# EAGLE design lightningbug (EAGLE 6.6.0)
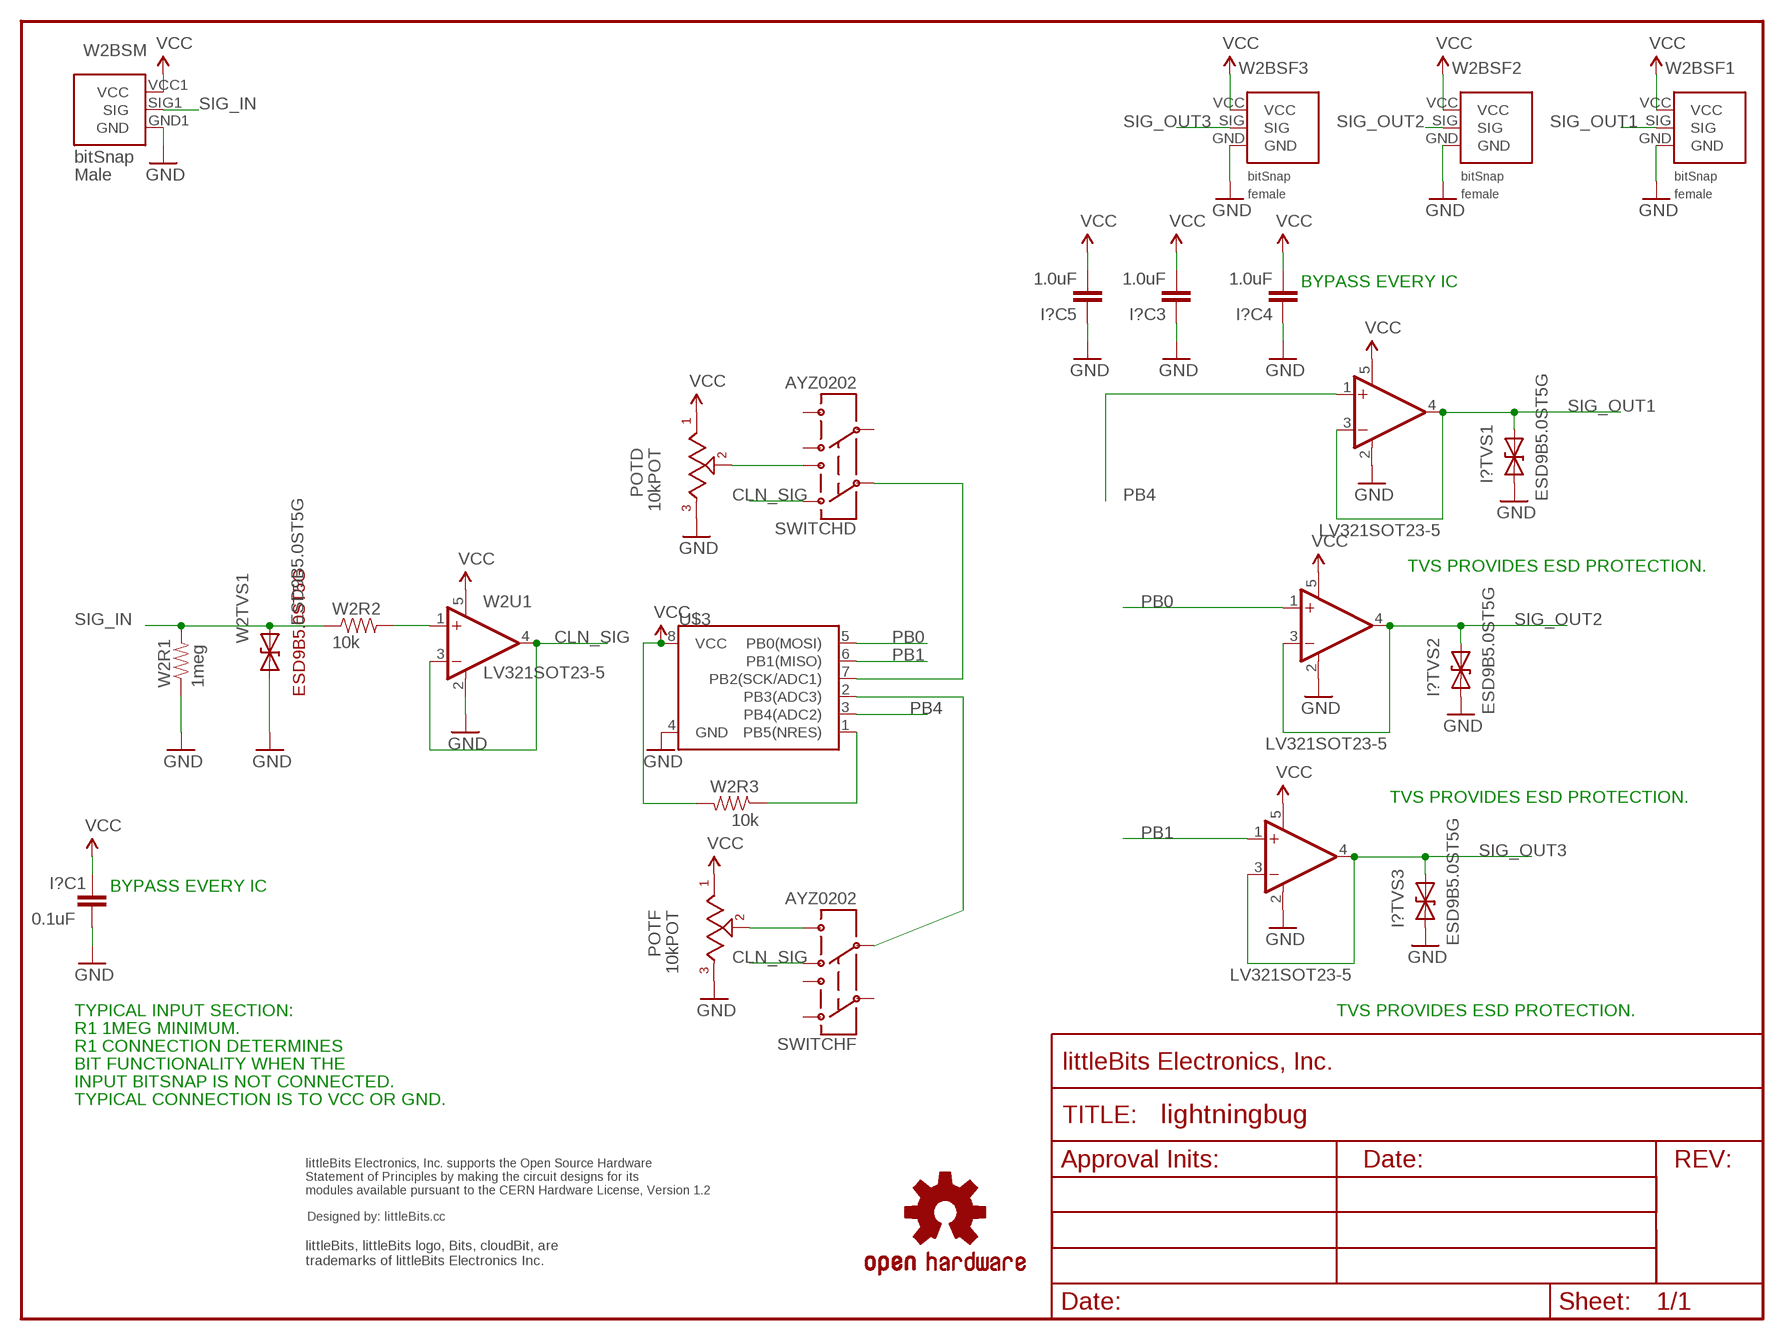
[diagram p0: schematic, sheet 1]

## Parts
FRAME1  FRAME-LETTER  [FABDWG01-OHW]
I?C1  0.1uF  CAPCAP-0603  [CAP-0603]
I?C3  1.0uF  CAPCAP-0603  [CAP-0603]
I?C4  1.0uF  CAPCAP-0603  [CAP-0603]
I?C5  1.0uF  CAPCAP-0603  [CAP-0603]
I?TVS1  ESD9B5.0ST5G  DIODE-TVSSOD-923  [SOD-923]
I?TVS2  ESD9B5.0ST5G  DIODE-TVSSOD-923  [SOD-923]
I?TVS3  ESD9B5.0ST5G  DIODE-TVSSOD-923  [SOD-923]
POTD  10kPOT  TRIMPOT_SMD_3MM  [TRIMPOT_SMD_3MM]
POTF  10kPOT  TRIMPOT_SMD_3MM  [TRIMPOT_SMD_3MM]
SWITCHD  AYZ0202  [AYZ0202]
SWITCHF  AYZ0202  [AYZ0202]
U1  LV321SOT23-5  [SOT23-5]
U2  LV321SOT23-5  [SOT23-5]
U3  LV321SOT23-5  [SOT23-5]
U$1  OSHWCREDIT  [OSHWCREDIT]
U$3  ATTINY85  [SO08-EIAJ]
U$6  OSHW-LOGOL  [OSHW-LOGO-L]
W2BSF1  BITSNAP_V03_FEMALE  [BITSNAP_V03_FEMALE]
W2BSF2  BITSNAP_V03_FEMALE  [BITSNAP_V03_FEMALE]
W2BSF3  BITSNAP_V03_FEMALE  [BITSNAP_V03_FEMALE]
W2BSM  BITSNAP_V03_MALE  [BITSNAP_V03_MALE]
W2R1  1meg  RESISTOR0603  [RES-0603]
W2R2  10k  RESISTOR0603  [RES-0603]
W2R3  10k  RES-0603  [RES-0603]
W2TVS1  ESD9B5.0ST5G  DIODE-TVSSOD-923  [SOD-923]
W2U1  LV321SOT23-5  [SOT23-5]

## Nets
CLN_SIG: SWITCHD.1 SWITCHF.4 W2U1.3(-IN) W2U1.4(OUT)
GND: I?C1.2 I?C3.1 I?C4.1 I?C5.1 I?TVS1.1(A) I?TVS2.1(A) I?TVS3.1(A) POTD.3 POTF.3 U1.2(V-) U2.2(V-) U3.2(V-) U$3.4(GND) W2BSF1.GND W2BSF2.GND W2BSF3.GND W2BSM.GND1(GND) W2R1.1 W2TVS1.1(A) W2U1.2(V-)
N$1: POTF.2 SWITCHF.6
N$3: W2R2.2 W2U1.1(+IN)
N$5: POTD.2 SWITCHD.3
NRES: U$3.1(PB5(NRES)) W2R3.1
PB0: U2.1(+IN) U$3.5(PB0(MOSI))
PB1: U3.1(+IN) U$3.6(PB1(MISO))
PB2: SWITCHD.2 U$3.7(PB2(SCK/ADC1))
PB3: SWITCHF.5 U$3.2(PB3(ADC3))
PB4: U1.1(+IN) U$3.3(PB4(ADC2))
SIG_IN: W2BSM.SIG1(SIG) W2R1.2 W2R2.1 W2TVS1.2(C)
SIG_OUT1: I?TVS1.2(C) U1.3(-IN) U1.4(OUT) W2BSF1.SIG
SIG_OUT2: I?TVS2.2(C) U2.3(-IN) U2.4(OUT) W2BSF2.SIG
SIG_OUT3: I?TVS3.2(C) U3.3(-IN) U3.4(OUT) W2BSF3.SIG
VCC: I?C1.1 I?C3.2 I?C4.2 I?C5.2 POTD.1 POTF.1 U1.5(V+) U2.5(V+) U3.5(V+) U$3.8(VCC) W2BSF1.VCC W2BSF2.VCC W2BSF3.VCC W2BSM.VCC1(VCC) W2R3.2 W2U1.5(V+)
Unconnected: SWITCHD.4 SWITCHD.5 SWITCHD.6 SWITCHF.1 SWITCHF.2 SWITCHF.3

## Notes on the sheet
- BYPASS EVERY IC
- TVS PROVIDES ESD PROTECTION.
- TVS PROVIDES ESD PROTECTION.
- BYPASS EVERY IC
- TYPICAL INPUT SECTION: | TVS PROVIDES ESD PROTECTION.
- R1 1MEG MINIMUM.
- R1 CONNECTION DETERMINES
- BIT FUNCTIONALITY WHEN THE
- INPUT BITSNAP IS NOT CONNECTED.
- TYPICAL CONNECTION IS TO VCC OR GND.

## Library data of the parts
FRAME1 = LITTLEBITS:FRAME-LETTER
I?C1 I?C3-I?C5 = LITTLEBITS:CAP
I?TVS1-I?TVS3 W2TVS1 = LITTLEBITS:DIODE-TVS: Bidirectional Transient Voltage Suppression Diode: Device conducts in avalanche mode after reaching a part dependent voltage threshold. Used for limiting voltage spikes on ESD sensitive inputs and outputs.; IEC_ESD_PROT0: +/-18kV; LB_PN: ?; MPN: ESD9B5.0ST5G; V_CLAMP: ?; V_OPERATION: 5V
POTD POTF = LITTLEBITS140915:TRIMPOT_SMD_3MM
SWITCHD SWITCHF = LITTLEBITS140915:AYZ0202
U1-U3 W2U1 = LITTLEBITS:LV321
U$1 = LITTLEBITS:OSHWCREDIT
U$3 = LITTLEBITS140915:ATTINY85
U$6 = LITTLEBITS140915:OSHW-LOGO: Open Source Hardware Logo This logo indicates the piece of hardware it is found on incorporates a OSHW license and/or adheres to the definition of open source hardware found here: http://freedomdefined.org/OSHW
W2BSF1-W2BSF3 = bitSnap:BITSNAP_V03_FEMALE
W2BSM = bitSnap:BITSNAP_V03_MALE
W2R1 W2R2 = LITTLEBITS:RESISTOR
W2R3 = LITTLEBITS140915:RES-0603: Resistor

## Board
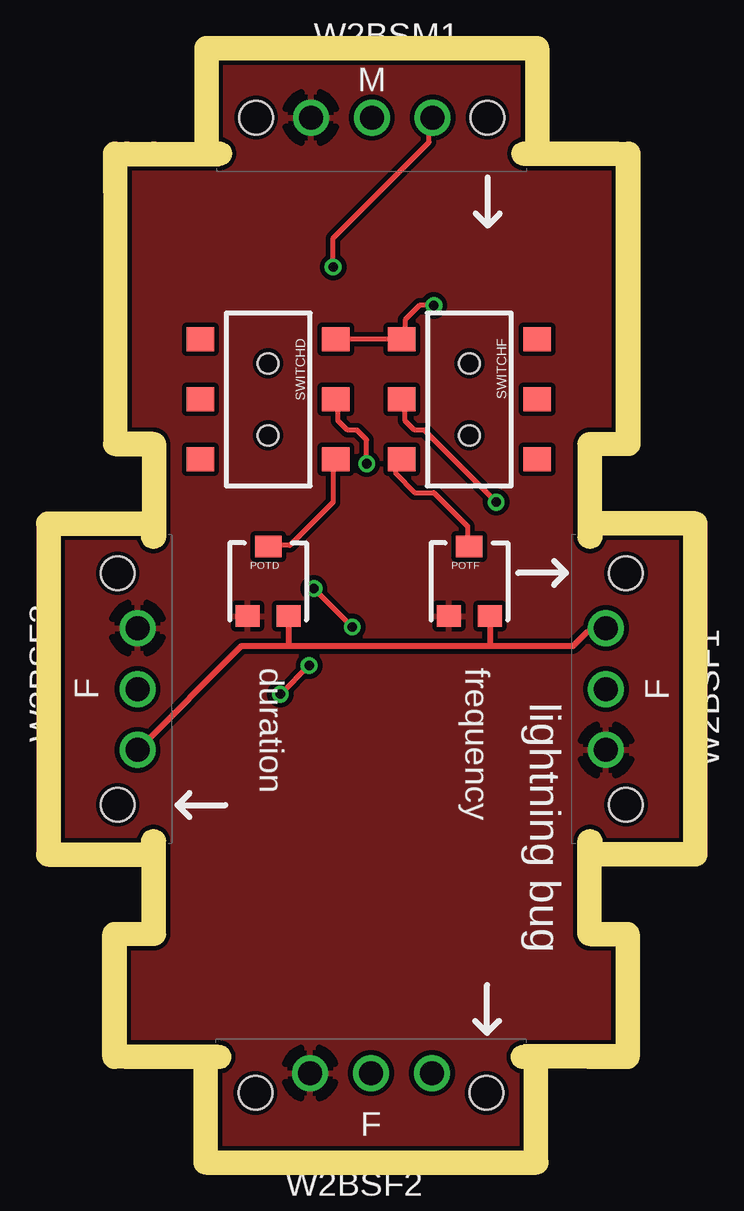
[diagram p1: board, top side]
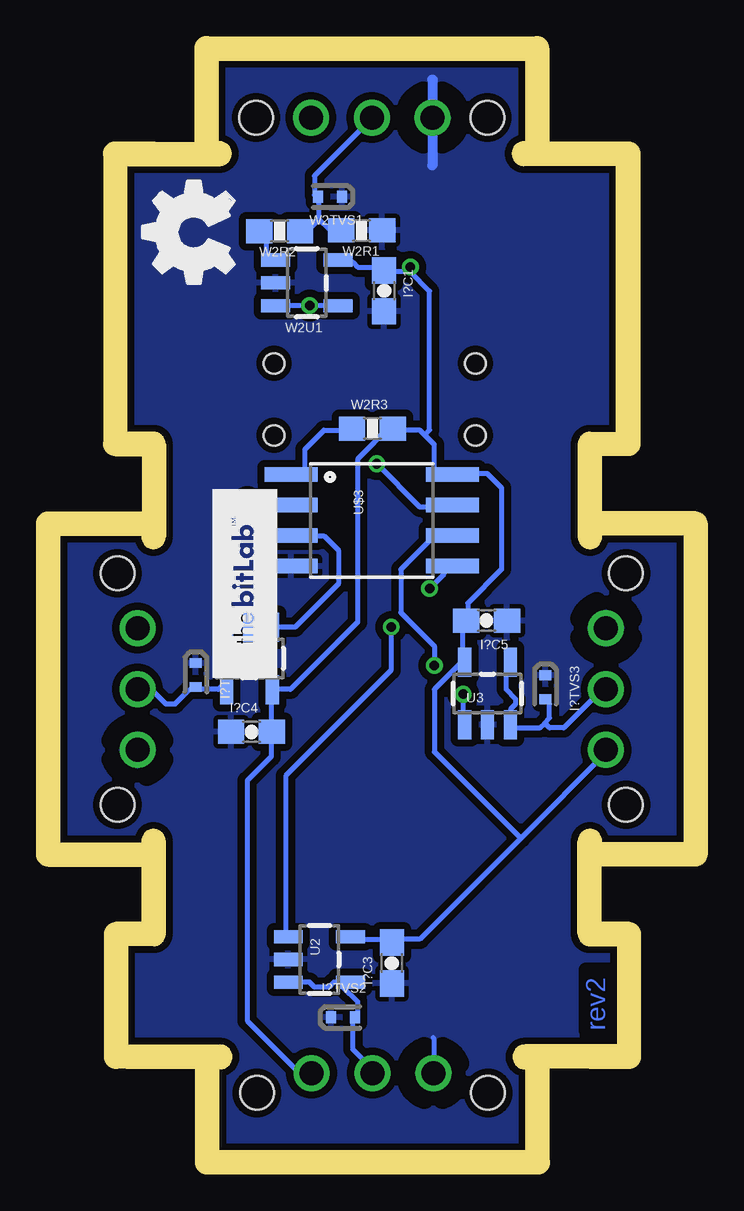
[diagram p2: board, bottom side, seen from below]

Size 26 x 45.44 mm. Coordinates in mm from the lower left corner, seen from the top.
Outline: 2.77,4.4 2.77,8.53 3.89,8.53 arc90 4.4,9.03
Outline: 23.17,4.4 23.17,8.53 22.1,8.53 arc-90 21.6,9.03
Outline: 23.2,41.04 23.2,29.93 22.1,29.93 arc90 21.6,29.43
Outline: 4.4,29.43 arc90 3.9,29.93 2.8,29.93 2.8,41.04
Copper layers (1*16): Top 0.035mm / dielectric 1.5mm / Bottom 0.035mm
Design rules "littleBitsDRC": minimum track width 0.2mm, minimum drill 0.4mm, track to track 0.2mm, track to pad 0.2mm, pad to pad 0.2mm, via to via 0.2mm, smd to smd 0mil, copper to edge 0.2mm, drill to drill 0.2mm, minimum pad ring 0.2mm, minimum via ring 0.15mm, stop-mask expansion 0.1mm, vias tented up to drill 0mil, thermal gap 0.2mm
Milling: 13 lines

### Footprints (pad centres in the part's own frame; a part is rotated, then mirrored left to right if it is on the bottom)
CAP-0603 = smd 1.1 x 1: 1 -0.85,0; 2 0.85,0
SOD-923 = smd 0.4 x 0.5: 1 -0.5,0; 2 0.5,0
TRIMPOT_SMD_3MM = smd 1 x 0.9: 1 0.85,-1.45; 3 -0.85,-1.45 | smd 1.1 x 0.9: 2 0,1.45
AYZ0202 = smd 1 x 1.15: 1 -2.5,2.825; 2 0,2.825; 3 2.5,2.825; 4 -2.5,-2.825; 5 0,-2.825; 6 2.5,-2.825 | hole 0.85: 1.5,0; -1.5,0
SOT23-5 = smd 0.55 x 1.2: 1 -0.95,-1.3; 2 0,-1.3; 3 0.95,-1.3; 4 0.95,1.3; 5 -0.95,1.3
SO08-EIAJ = smd 0.61 x 2.21: 1 -1.905,-3.378; 2 -0.635,-3.378; 3 0.635,-3.378; 4 1.905,-3.378; 5 1.905,3.353; 6 0.635,3.353; 7 -0.635,3.353; 8 -1.905,3.353
BITSNAP_V03_FEMALE = drill 1: GND 4.065,3.44; SIG 6.605,3.44; VCC 9.145,3.44 | hole 1.4: 1.785,2.61; 11.425,2.61
BITSNAP_V03_MALE = drill 1: GND1 9.145,2.61; SIG1 6.605,2.61; VCC1 4.065,2.61 | hole 1.4: 1.785,2.61; 11.425,2.61
RES-0603 = smd 1.1 x 1: 1 -0.85,0; 2 0.85,0

### Placement (x,y rotation side)
FRAME1  -0.21,-0.58 0 top
I?C1  12.48,35.82 270 bottom
I?C3  12.16,7.82 90 bottom
I?C4  18.02,17.45 0 bottom
I?C5  8.21,22.09 180 bottom
I?TVS1  20.34,19.81 270 bottom
I?TVS2  14.2,5.55 0 bottom
I?TVS3  5.76,19.3 270 bottom
POTD  8.68,23.71 0 top
POTF  17.07,23.71 0 top
SWITCHD  8.68,31.29 270 top
SWITCHF  17.07,31.29 270 top
U1  18.1,20.5 180 bottom
U2  15.18,7.97 270 bottom
U3  8.17,19.04 0 bottom
U$1  -92.58,-62.55 0 top  (outside the outline)
U$2  [BITLAB-LOGO]  16.95,27.54 270 top
U$3  12.99,26.26 270 bottom
U$5  [OSHW_FILLX150_NOTEXT]  18.74,35.31 0 top
U$6  -33.62,-68.41 0 top  (outside the outline)
W2BSF1  26.21,12.62 90 top
W2BSF2  6.37,-0.21 0 top
W2BSF3  -0.21,25.84 270 top
W2BSM  19.61,45.65 180 top
W2R1  13.42,38.34 180 bottom
W2R2  16.84,38.31 180 bottom
W2R3  12.97,30.08 0 bottom
W2TVS1  14.74,39.74 180 bottom
W2U1  15.71,36.16 270 bottom

### Tracks (layer width: path | path; a pad name or v marks a point on that pad's centre or on a via)
CLN_SIG  (via drill 0.4)
  Top 0.2: SWITCHD.1 11.59,33.81 14.19,33.81 SWITCHF.4 14.39,33.81 14.39,34.62 14.99,35.21 v15.59,35.21
  Bottom 0.2: W2U1.4 14.59,35.21 v15.59,35.21 16.99,35.21 W2U1.3
GND
  Bottom 0.2: 10.43,4.7 10.39,4.62 10.39,3.42 W2BSF2.GND
  Bottom 0.406: 10.45,44.62 10.47,44.62 10.47,41.04
  pour Bottom (isolate 0.305): 0.11,45.3 25.82,45.47 25.77,-0.11 0.16,-0.32
  pour Top: 0.2,45.41 25.93,45.44 25.88,-0.16 0.25,-0.21
N$1
  Top 0.2: POTF.2 16.99,25.21 16.99,26.02 15.59,27.41 14.79,27.41 13.99,28.21 13.99,28.41 14.19,28.61 SWITCHF.6
N$3
  Bottom 0.2: W2R2.2 17.39,38.21 17.39,37.41 17.19,37.21 W2U1.1
N$5
  Top 0.2: POTD.2 8.79,25.21 9.59,25.21 11.39,27.02 11.39,28.61 SWITCHD.3
NRES
  Bottom 0.2: W2R3.1 13.99,30.02 14.99,30.02 15.79,29.21 15.79,28.41 16.19,28.02 U$3.1
PB0  (via drill 0.4)
  Top 0.2: v10.59,23.41 v12.19,21.81
  Bottom 0.2: v12.19,21.81 12.19,20.02 16.59,15.61 16.59,9.02 U2.1 | v10.59,23.41 9.99,24.02 9.99,24.21 9.79,24.41 U$3.5
PB1  (via drill 0.4)
  Top 0.2: v10.39,20.21 v9.19,19.02
  Bottom 0.2: v9.19,19.02 9.19,17.81 U3.1 | v10.39,20.21 10.39,21.02 11.79,22.41 11.79,24.21 10.39,25.61 9.79,25.61 U$3.6
PB2  (via drill 0.4)
  Top 0.2: v12.79,28.61 12.79,29.61 12.39,30.02 11.99,30.02 11.59,30.41 11.59,31.21 SWITCHD.2
  Bottom 0.2: v12.79,28.61 10.99,26.81 9.79,26.81 U$3.7
PB3  (via drill 0.4)
  Top 0.2: v18.19,27.02 15.19,30.02 14.79,30.02 14.39,30.41 14.39,31.21 SWITCHF.5
  Bottom 0.2: v18.19,27.02 17.99,26.81 16.39,26.81 U$3.2
PB4
  Bottom 0.2: U1.1 16.99,21.81 16.19,21.81 14.39,23.61 14.39,25.02 14.99,25.61 16.19,25.61 U$3.3
SIG_IN
  Bottom 0.2: 15.19,38.81 15.19,39.62 W2TVS1.2 15.39,39.81 15.39,40.62 12.99,43.02 W2BSM.SIG1 | 15.19,38.81 15.59,38.41 W2R2.1 15.19,38.81 | 15.19,38.81 14.79,38.41 14.39,38.41 W2R1.2
SIG_OUT1
  Bottom 0.2: 18.99,19.21 19.19,19.41 19.39,19.21 20.19,19.21 I?TVS1.2 20.39,19.21 20.59,19.21 21.19,18.61 21.59,18.61 22.19,19.21 22.59,19.21 W2BSF1.SIG | 18.99,19.21 18.99,19.81 19.19,20.02 19.19,21.61 U1.3 | 18.99,19.21 U1.4
SIG_OUT2
  Bottom 0.2: 14.19,7.01 14.19,6.82 13.59,6.21 13.59,5.62 I?TVS2.2 13.79,5.42 13.79,4.21 12.99,3.42 W2BSF2.SIG | 14.19,7.01 U2.4 13.99,7.01 | U2.3 15.59,7.01 15.39,6.82 14.79,6.82 14.59,7.01 14.19,7.01
SIG_OUT3
  Bottom 0.2: 5.79,17.81 5.99,17.61 7.19,17.61 U3.3 7.19,17.81 7.19,18.41 6.99,18.61 6.99,18.81 7.39,19.21 7.39,20.21 U3.4 | 5.79,17.81 5.59,18.02 5.59,18.61 I?TVS3.2 | 5.79,17.81 5.59,17.61 4.99,17.61 3.39,19.21 W2BSF3.SIG
VCC  (via drill 0.4)
  Top 0.2: 22.59,21.61 W2BSF1.VCC | 3.19,16.81 W2BSF3.VCC | v11.39,36.81 11.39,38.02 15.39,42.02 15.39,43.02 W2BSM.VCC1
  Top 0.254: 17.88,21.02 21.39,21.02 21.99,21.61 22.59,21.61 | 17.88,21.02 9.44,21.02 | 9.44,21.02 7.55,21.02 W2BSF3.VCC | POTF.1 17.92,21.06 17.88,21.02 | POTD.1 9.53,21.1 9.44,21.02
  Bottom 0.2: U2.5 13.79,8.82 12.19,8.82 I?C3.2 11.99,8.82 10.99,8.82 6.79,13.02 | 6.79,13.02 3.19,16.61 W2BSF3.VCC | W2U1.5 14.39,37.02 13.79,37.02 13.59,36.81 12.59,36.81 I?C1.1 12.39,36.62 11.39,36.62 | 9.19,20.41 9.19,22.02 I?C5.2 8.99,22.21 8.99,22.81 7.59,24.21 7.59,27.61 8.19,28.21 9.59,28.21 U$3.8 9.79,28.21 10.19,28.21 10.39,28.41 10.39,29.41 10.79,29.81 | 10.79,29.81 10.99,30.02 11.99,30.02 W2R3.2 12.19,30.21 13.59,28.81 13.59,22.02 16.39,19.21 16.99,19.21 U1.5 17.19,19.02 17.19,17.61 I?C4.2 17.19,17.41 17.19,16.41 18.19,15.41 18.19,5.42 16.19,3.42 15.59,3.42 W2BSF2.VCC | 11.39,36.62 10.59,35.81 10.59,30.02 10.79,29.81 | 11.39,36.62 v11.39,36.81 | 6.79,13.02 10.39,16.61 10.39,19.21 9.19,20.41 | 9.19,20.41 U3.5
  Bottom 0.406: 15.58,43.11 W2BSM.VCC1

### Text on the board
Bottom: rev2
tPlace: duration | frequency | lightning bug
tNames: W2BSM1 | W2BSF1 | W2BSF3 | W2BSF2
Reference: 1mm DIA. ROUTER PATH